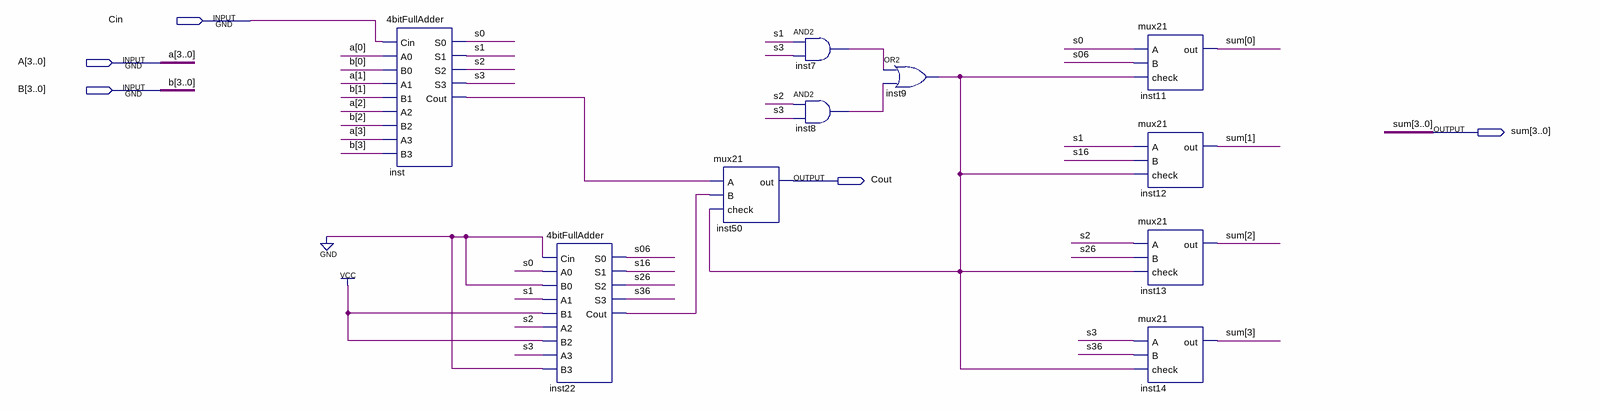
[diagram p0: schematic sheet]
// Quartus schematic BCDAdder.bdf as structural Verilog: 10 symbols, 5 pins
module BCDAdder (
  input  Cin,
  input  [3:0] A,
  input  [3:0] B,
  output [3:0] sum,
  output Cout
);

  wire inst7_out, inst8_out, inst9_out, inst22_cout, inst_cout, s0, s1, s2, s3, s06, s16, s26, s36;

  \4bitFullAdder  inst (
    .Cin(Cin), .A0(A[0]), .B0(B[0]), .A1(A[1]), .B1(B[1]), .A2(A[2]), .B2(B[2]), .A3(A[3]), .B3(B[3]),
    .S0(s0), .S1(s1), .S2(s2), .S3(s3), .Cout(inst_cout));
  \4bitFullAdder  inst22 (
    .Cin(1'b0), .A0(s0), .B0(1'b0), .A1(s1), .B1(1'b1), .A2(s2), .B2(1'b1), .A3(s3), .B3(1'b0), .S0(s06),
    .S1(s16), .S2(s26), .S3(s36), .Cout(inst22_cout));
  mux21 inst50 (.A(inst_cout), .B(inst22_cout), .check(inst9_out), .out(Cout));
  and inst7 (inst7_out, s1, s3);
  and inst8 (inst8_out, s2, s3);
  or inst9 (inst9_out, inst7_out, inst8_out);
  mux21 inst11 (.A(s0), .B(s06), .check(inst9_out), .out(sum[0]));
  mux21 inst12 (.A(s1), .B(s16), .check(inst9_out), .out(sum[1]));
  mux21 inst13 (.A(s2), .B(s26), .check(inst9_out), .out(sum[2]));
  mux21 inst14 (.A(s3), .B(s36), .check(inst9_out), .out(sum[3]));
endmodule
